# Altium schematic sheet IRController.SchDoc
size A4
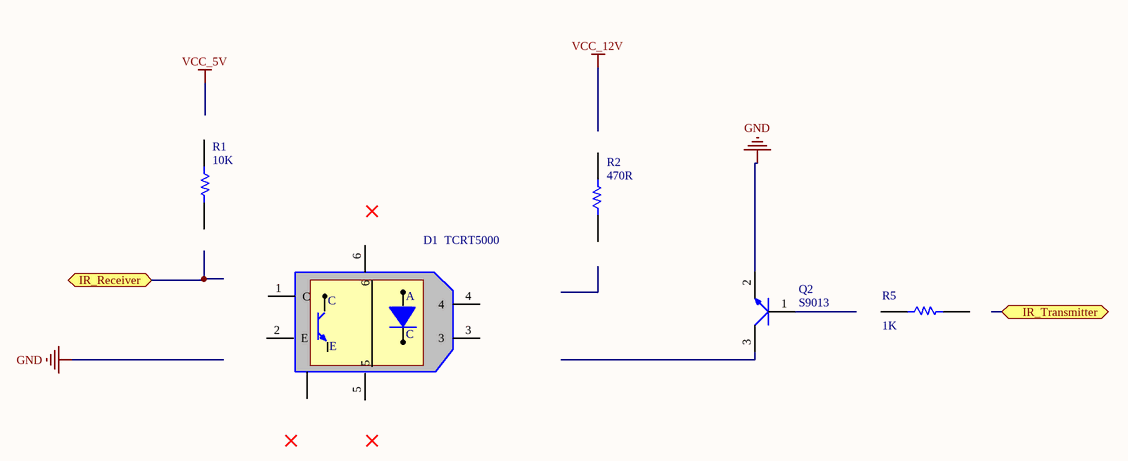
[diagram p0: IRController.SchDoc]

## Parts
D1  TCRT5000  [TCRT5000]
Q2  S9013  [SOT95P278X125-3N]
R1  10K  [RESC2608X06N_0603]
R2  470R  [RESC2608X06N_0603]
R5  1K  [RESC2608X06N_0603]

## Ports
IR_Receiver, IR_Transmitter

## Nets
GND: Q2.2(C)

Not connected (* = marked no-connect by the designer): D1 1(C) 2(E) 3 4 5 6 7; Q2 1(B) 3; R1 1 2; R2 1 2; R5 1 2

## Notes on the sheet
- Designed By
- Checked By
- Address1:
- Address2:
- Size:       A4
- Sheet:
- /
- (in symbol TCRT5000) A

## Library data of the parts
Q2 = Transitor S9013 NPN: SOT-23 Plastic-Encapsulate Transistors
R1 = R10k_0603_5%: RES SMD 10K OHM 1% 1/4W 0603; Supplier 1: Digi-Key; Supplier Part Number 1: 541-10.0KSCT-ND
R2 = R470_0603_5%: Thick Film Resistors - SMD 470 ohm 5%; Supplier 1: Digi-Key; Supplier Part Number 1: CR0603-JW-471ELFCT-ND
R5 = 1k_0603_5%: Thick Film Resistors - SMD 0603 1kOHMS 5% 1/10WATT; Supplier 1: Digi-Key; Supplier Part Number 1: CR0603-JW-101ELFCT-ND